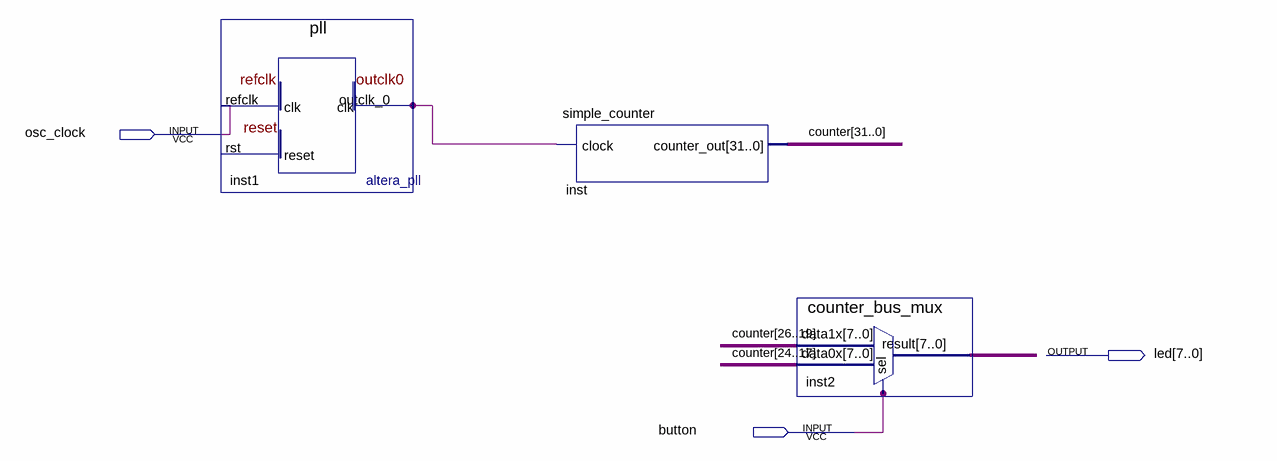
[diagram p0: schematic sheet]
// Quartus schematic my_first_fpga.bdf as structural Verilog: 3 symbols, 3 pins
module my_first_fpga (
  input  osc_clock,
  input  button,
  output [7:0] led
);

  wire inst1_outclk_0;
  wire [7:0] inst2_result;
  wire [31:0] counter;

  pll inst1 (.refclk(osc_clock), .outclk_0(inst1_outclk_0));  // open: rst
  simple_counter inst (.clock(inst1_outclk_0), .counter_out(counter));
  counter_bus_mux inst2 (.data1x(counter[26:19]), .data0x(counter[24:17]), .sel(button), .result(inst2_result));
endmodule
